# EasyEDA Pro project ProPrj_transverter-front-end_2026-04-14.epro, board 1-PCB_PCB_transverter-filter-board
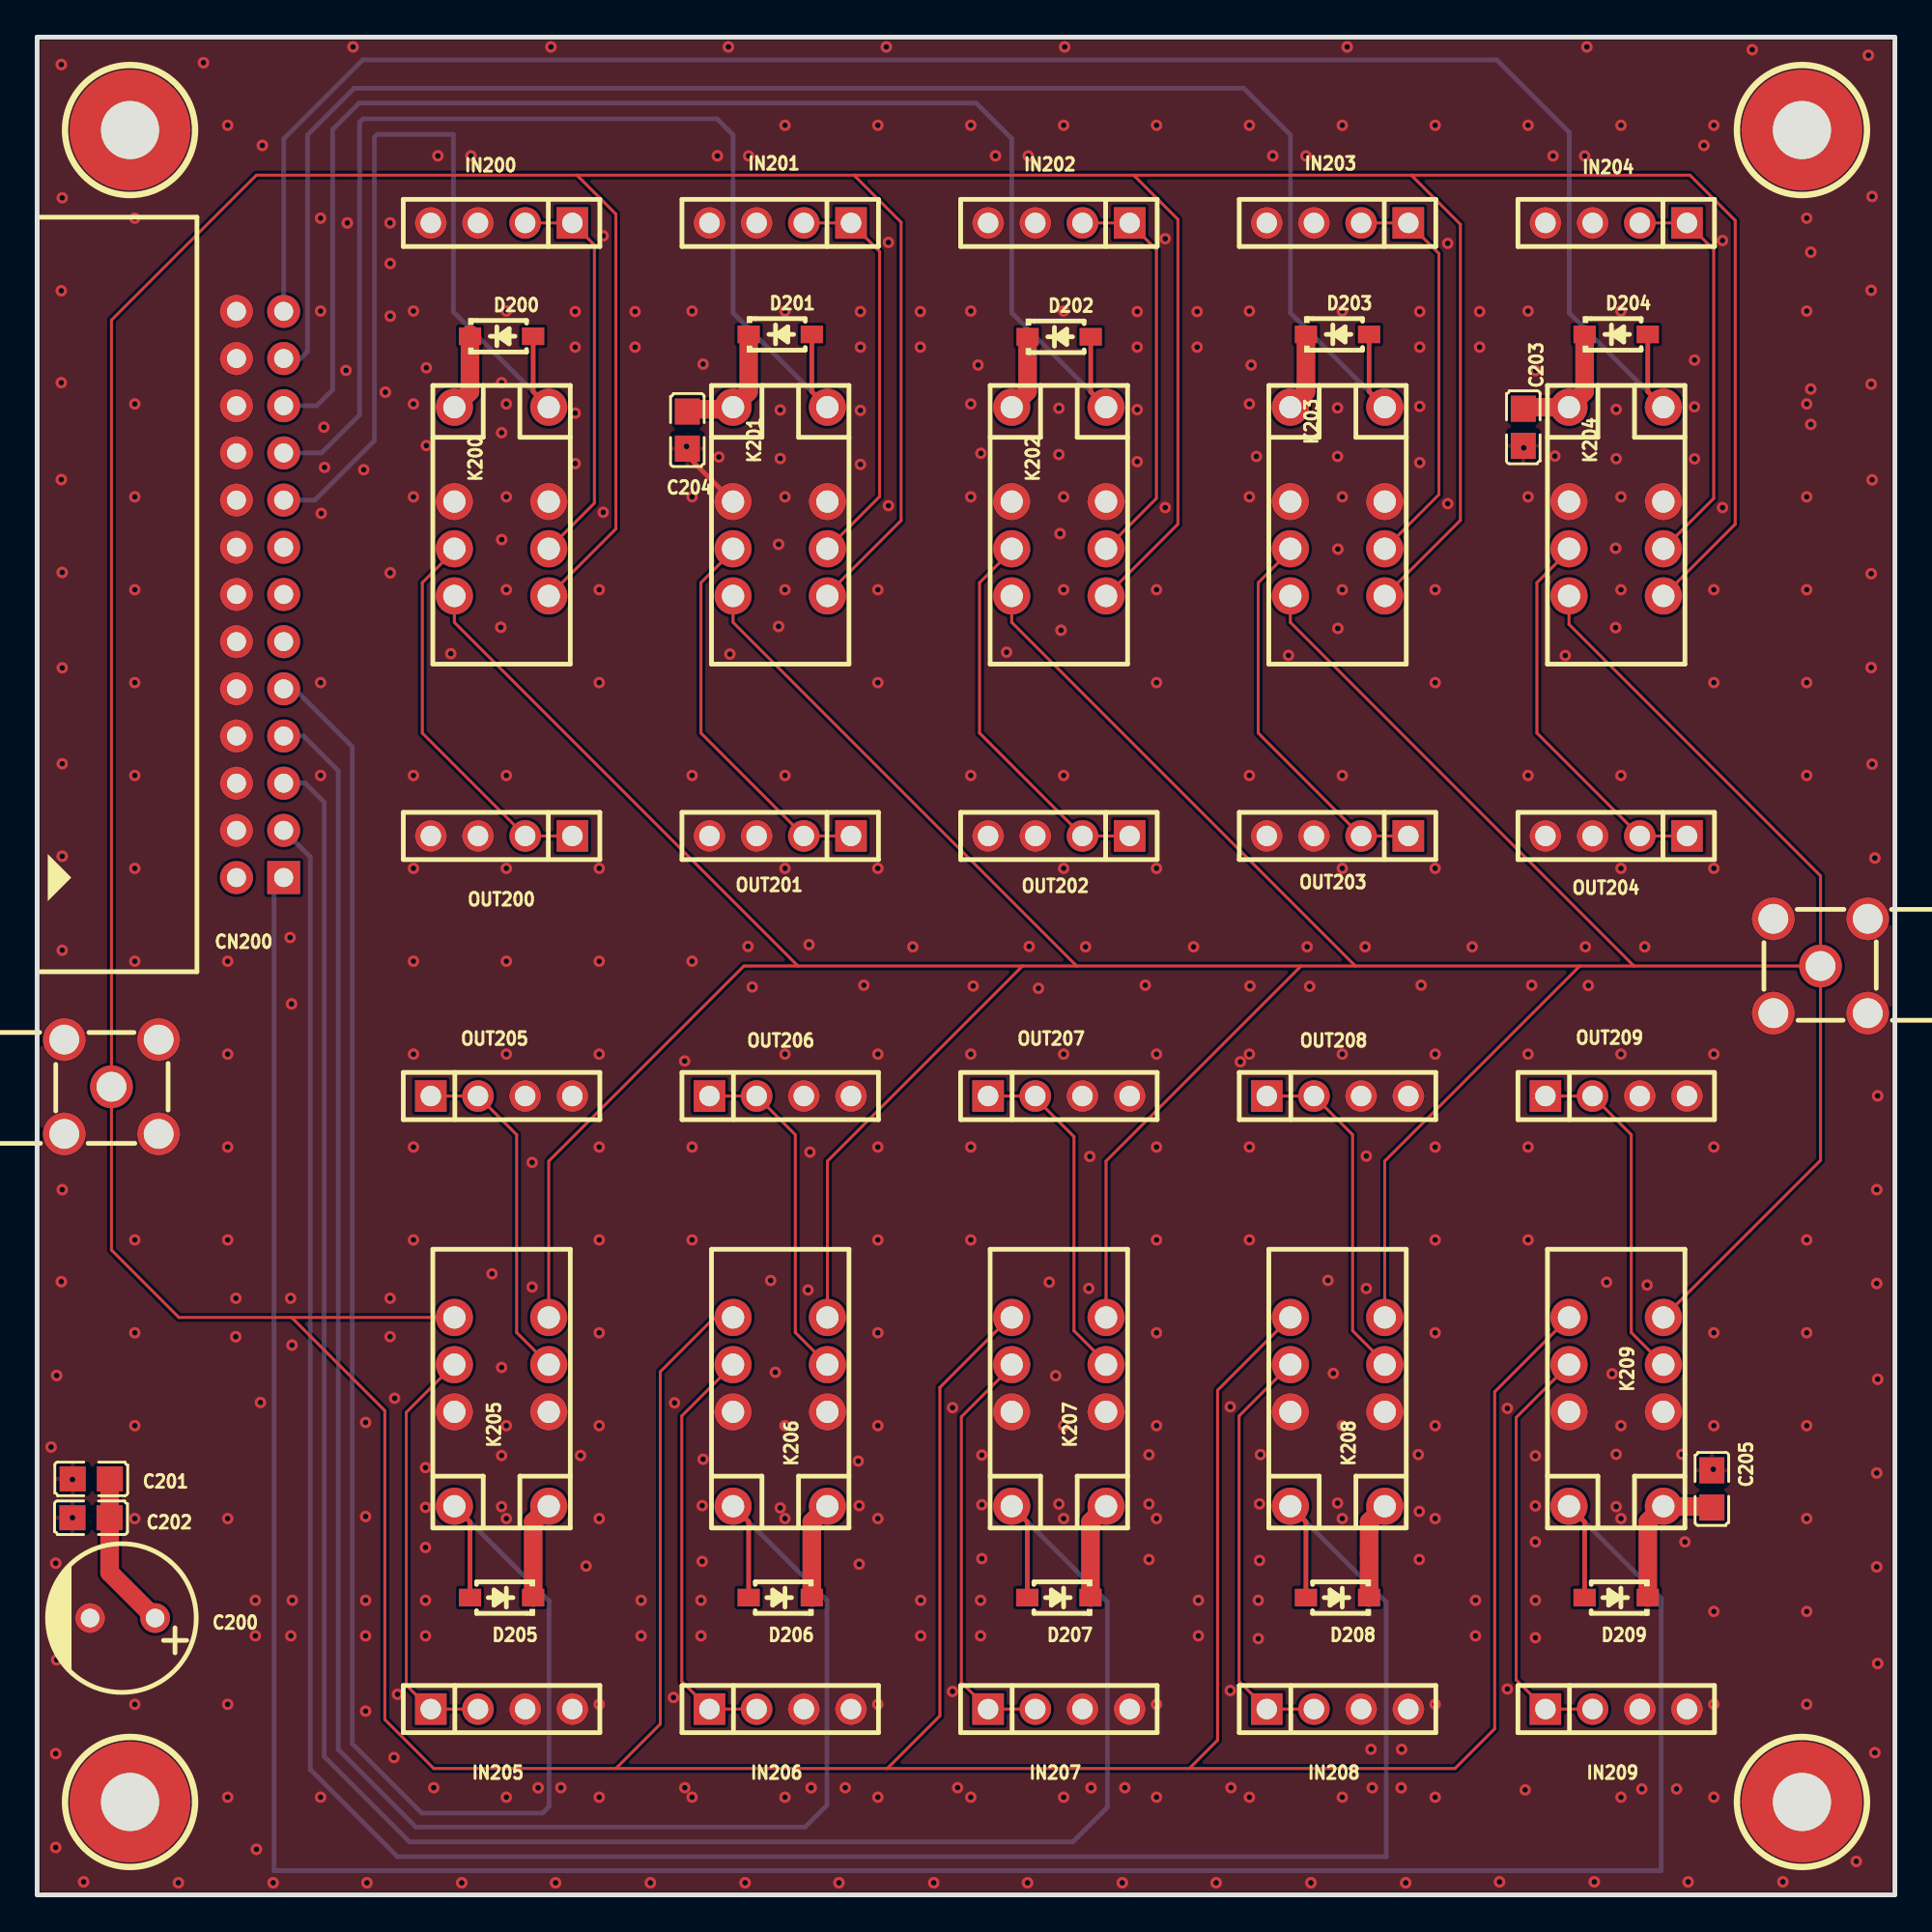
[diagram p7: board, top side]
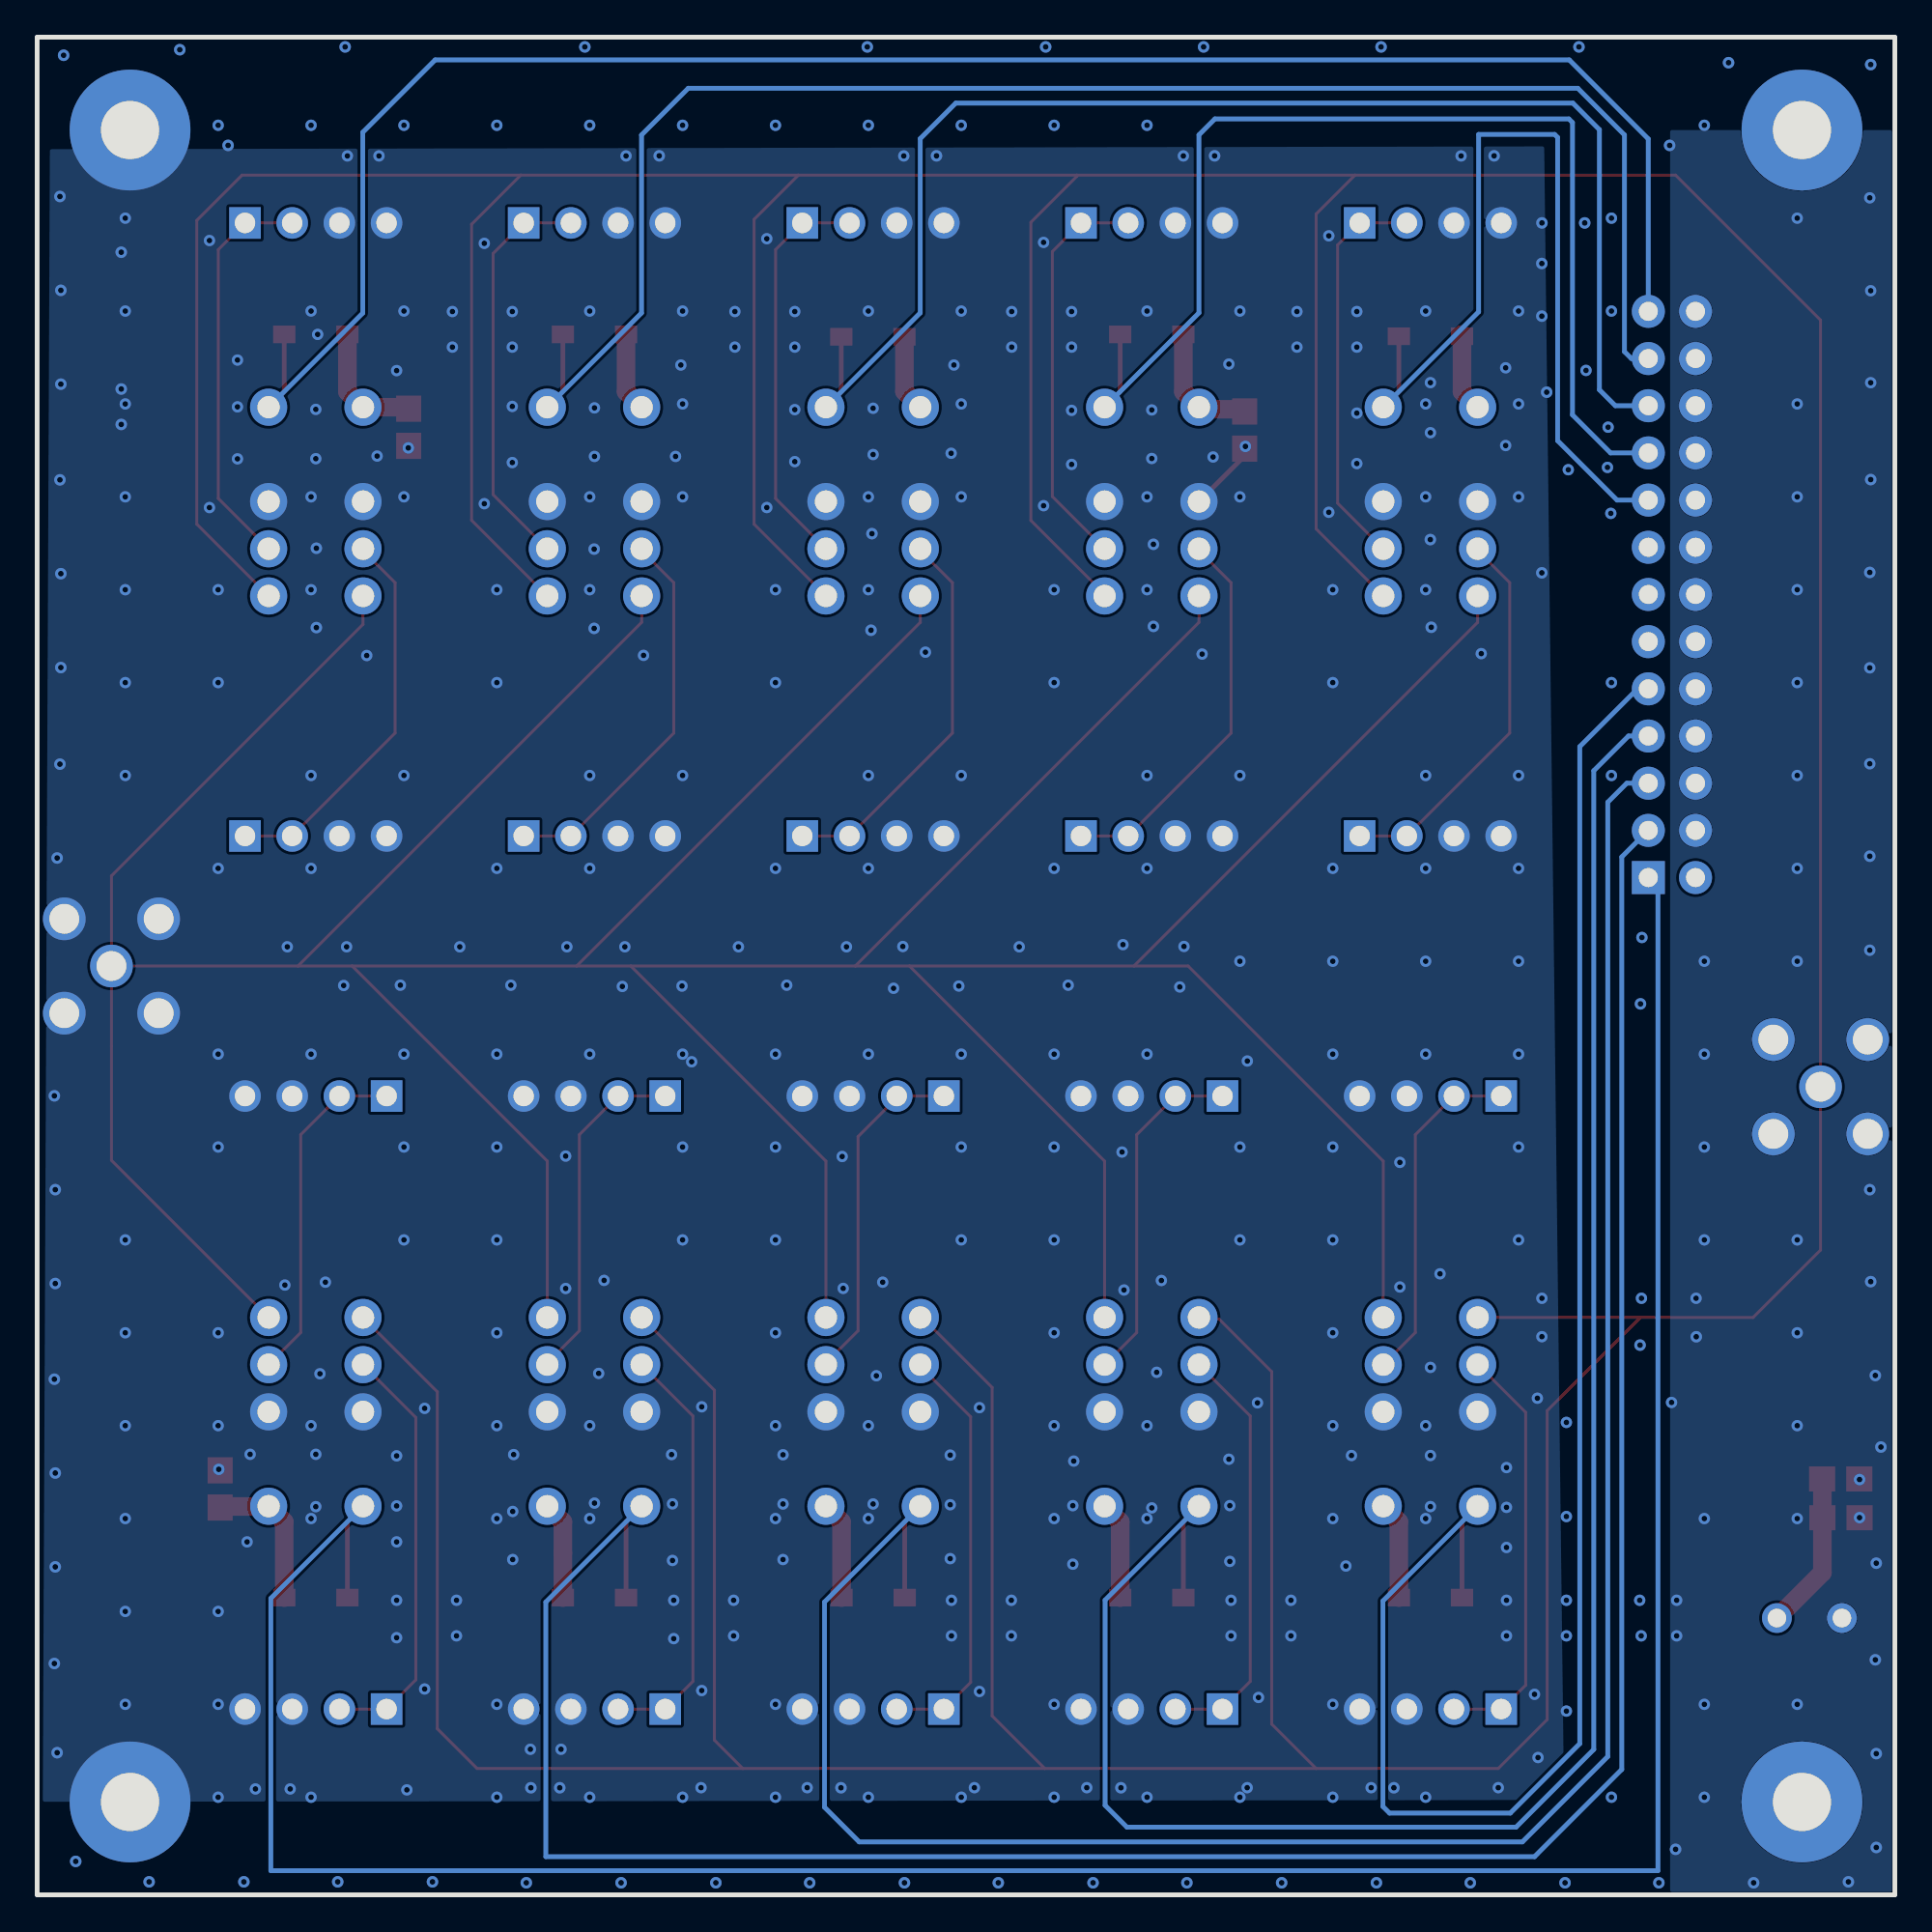
[diagram p8: board, bottom side, seen from below]

Outline 100 x 100 mm; copper layers: Top Layer, Inner1, Inner2, Bottom Layer. Coordinates in mm from the lower left corner of the outline.
Outline path: 0,100 0,0 100,0 100,100 0,100
Stack: Top Layer 0.035mm / Dielectric1 0.48mm PP er 4.5 / Inner1 0.035mm / Dielectric2 0.48mm FR4 er 4.5 / Inner2 0.035mm / Dielectric3 0.48mm PP er 4.5 / Bottom Layer 0.035mm

## Design rules (mm)
net RF-IN-BUS: RF
net RF-OUT-BUS: RF
net RLY-5-EN: control_lines
net RLY-2-EN: control_lines
net RLY-10-EN: control_lines
net RLY-4-EN: control_lines
net RLY-3-EN: control_lines
net RLY-1-EN: control_lines
net RLY-7-EN: control_lines
net RLY-8-EN: control_lines
net RLY-9-EN: control_lines
net RLY-6-EN: control_lines
net RF1-IN: RF
net RF2-IN: RF
net RF3-IN: RF
net RF4-IN: RF
net RF5-IN: RF
net RF6-IN: RF
net RF7-IN: RF
net RF8-IN: RF
net RF9-IN: RF
net RF10-IN: RF
net RF1-OUT: RF
net RF2-OUT: RF
net RF3-OUT: RF
net RF4-OUT: RF
net RF5-OUT: RF
net RF6-OUT: RF
net RF7-OUT: RF
net RF8-OUT: RF
net RF9-OUT: RF
net RF10-OUT: RF
template: User Custom Config
spacing Default (default): track to track 0.152, other pairs 0 to 0.152
spacing RF: track to track 1, other pairs 0 to 0.65
spacing clean_voltage: track to track 0.152, other pairs 0.152 to 0.3
spacing control_lines: track to track 0.5, other pairs 0.152 to 0.3
spacing ground_guard: track to track 0.3, other pairs 0.152 to 0.3
spacing main_power: track to track 2, other pairs 0.152 to 0.3
spacing relay_power: track to track 1, other pairs 0.152 to 0.3
spacing small_components: track to track 0.152, other pairs 0.152 to 0.3
spacing small_power: track to track 0.6, other pairs 0.152 to 0.3
track width Default: min 0.254, default 0.254, max 25.4
track width RF (default): min 0.157, default 0.157, max 0.157
track width control_lines: min 0.25, default 0.25, max 0.26
track width main_power: min 1.5, default 1.5, max 3
track width relay_power: min 1, default 1, max 1.25
track width small_power: min 0.5, default 0.5, max 2.54
differential pair differentialPair (default): width min 0.127, default 0.254, max 2.54; gap min 0.152, default 0.152
via Default (default): diameter min 0.61, default 0.61, max 100.025; hole min 0.305, default 0.305, max 59.995
via RF: diameter min 0.61, default 0.61, max 100.025; hole min 0.305, default 0.305, max 59.995
net class RF uses RF
net class control_lines uses control_lines
net RF-IN-BUS uses RF
net RF-OUT-BUS uses RF
net GND uses Default
net RLY-5-EN uses control_lines
net RLY-2-EN uses control_lines
net RLY-10-EN uses control_lines
net RLY-4-EN uses control_lines
net RLY-3-EN uses control_lines
net RLY-1-EN uses control_lines
net RLY-7-EN uses control_lines
net RLY-8-EN uses control_lines
net RLY-9-EN uses control_lines
net RLY-6-EN uses control_lines
net 5V-BUS uses relay_power
net RF1-IN uses RF
net RF2-IN uses RF
net RF3-IN uses RF
net RF4-IN uses RF
net RF5-IN uses RF
net RF6-IN uses RF
net RF7-IN uses RF
net RF8-IN uses RF
net RF9-IN uses RF
net RF10-IN uses RF
net RF1-OUT uses RF
net RF2-OUT uses RF
net RF3-OUT uses RF
net RF4-OUT uses RF
net RF5-OUT uses RF
net RF6-OUT uses RF
net RF7-OUT uses RF
net RF8-OUT uses RF
net RF9-OUT uses RF
net RF10-OUT uses RF
['net class', 'rf'] ['NET', 'GND'] uses ground_guard
pour e62 uses gge33003
pour e87 uses gge14488
pour e89 uses gge11851

## Placement (name value [footprint] x y rotation side)
C200  47 µF  [CAP-TH_BD8.0-P3.50-D0.6-FD]  4.6 14.9 180 top
C201  1uF  [C0805]  2.91 22.39 0 top
C202  100nF  [C0805]  2.9 20.3 180 top
C203  100nF  [C0805]  80 79 270 top
C204  100nF  [C0805]  35 78.85 90 top
C205  100nF  [C0805]  90.15 21.85 270 top
CN200  SBH11-PBPC-D13-RA-BK  [IDC-TH_26P-P2.54-H-M-R2-C13-W8.8]  12 70 270 top
D200  1N4148W-7-F  [SOD-123_L2.7-W1.6-LS3.7-RD-1]  25 83.9 0 top
D201  1N4148W-7-F  [SOD-123_L2.7-W1.6-LS3.7-RD-1]  40 84 0 top
D202  1N4148W-7-F  [SOD-123_L2.7-W1.6-LS3.7-RD-1]  55.01 83.87 0 top
D203  1N4148W-7-F  [SOD-123_L2.7-W1.6-LS3.7-RD-1]  70 84 0 top
D204  1N4148W-7-F  [SOD-123_L2.7-W1.6-LS3.7-RD-1]  85 84 0 top
D205  1N4148W-7-F  [SOD-123_L2.7-W1.6-LS3.7-RD-1]  25 16 180 top
D206  1N4148W-7-F  [SOD-123_L2.7-W1.6-LS3.7-RD-1]  40 16 180 top
D207  1N4148W-7-F  [SOD-123_L2.7-W1.6-LS3.7-RD-1]  55 16 180 top
D208  1N4148W-7-F  [SOD-123_L2.7-W1.6-LS3.7-RD-1]  70 16 180 top
D209  1N4148W-7-F  [SOD-123_L2.7-W1.6-LS3.7-RD-1]  85 16 180 top
IN200  PPPC041LFBN-RC  [HDR-TH_4P-P2.54-V-F]  25 90 180 top
IN201  PPPC041LFBN-RC  [HDR-TH_4P-P2.54-V-F]  40 90 180 top
IN202  PPPC041LFBN-RC  [HDR-TH_4P-P2.54-V-F]  55 90 180 top
IN203  PPPC041LFBN-RC  [HDR-TH_4P-P2.54-V-F]  70 90 180 top
IN204  PPPC041LFBN-RC  [HDR-TH_4P-P2.54-V-F]  85 90 180 top
IN205  PPPC041LFBN-RC  [HDR-TH_4P-P2.54-V-F]  25 10 0 top
IN206  PPPC041LFBN-RC  [HDR-TH_4P-P2.54-V-F]  40 10 0 top
IN207  PPPC041LFBN-RC  [HDR-TH_4P-P2.54-V-F]  55 10 0 top
IN208  PPPC041LFBN-RC  [HDR-TH_4P-P2.54-V-F]  70 10 0 top
IN209  PPPC041LFBN-RC  [HDR-TH_4P-P2.54-V-F]  85 10 0 top
K200  TX2-5V  [RELAY-TH_TX2-3V]  25 75 270 top
K201  TX2-5V  [RELAY-TH_TX2-3V]  40 75 270 top
K202  TX2-5V  [RELAY-TH_TX2-3V]  55 75 270 top
K203  TX2-5V  [RELAY-TH_TX2-3V]  70 75 270 top
K204  TX2-5V  [RELAY-TH_TX2-3V]  85 75 270 top
K205  TX2-5V  [RELAY-TH_TX2-3V]  25 26 90 top
K206  TX2-5V  [RELAY-TH_TX2-3V]  40 26 90 top
K207  TX2-5V  [RELAY-TH_TX2-3V]  55 26 90 top
K208  TX2-5V  [RELAY-TH_TX2-3V]  70 26 90 top
K209  TX2-5V  [RELAY-TH_TX2-3V]  85 26 90 top
NOREF  -  [Pad_e1373]  5 5 0 top
NOREF#2  -  [Pad_e1372]  95 5 0 top
NOREF#3  -  [Pad_e1371]  95 95 0 top
NOREF#4  -  [Pad_e1369]  5 95 0 top
OUT200  PPPC041LFBN-RC  [HDR-TH_4P-P2.54-V-F]  25 57 180 top
OUT201  PPPC041LFBN-RC  [HDR-TH_4P-P2.54-V-F]  40 57 180 top
OUT202  PPPC041LFBN-RC  [HDR-TH_4P-P2.54-V-F]  55 57 180 top
OUT203  PPPC041LFBN-RC  [HDR-TH_4P-P2.54-V-F]  70 57 180 top
OUT204  PPPC041LFBN-RC  [HDR-TH_4P-P2.54-V-F]  85 57 180 top
OUT205  PPPC041LFBN-RC  [HDR-TH_4P-P2.54-V-F]  25 43 0 top
OUT206  PPPC041LFBN-RC  [HDR-TH_4P-P2.54-V-F]  40 43 0 top
OUT207  PPPC041LFBN-RC  [HDR-TH_4P-P2.54-V-F]  55 43 0 top
OUT208  PPPC041LFBN-RC  [HDR-TH_4P-P2.54-V-F]  70 43 0 top
OUT209  PPPC041LFBN-RC  [HDR-TH_4P-P2.54-V-F]  85 43 0 top
SMA200  OUT  [ANT-TH_SMA-J-P-H-RA-TH1]  96 50 180 top
SMA201  IN  [ANT-TH_SMA-J-P-H-RA-TH1]  4 43.5 0 top

## Footprints (pads in the part's own frame, mm; a bottom-side part is the same pattern mirrored in y, then rotated)
ANT-TH_SMA-J-P-H-RA-TH1
  round 2.3 hole 1.6: 1(-2.54,2.54) 2(2.54,2.54) 3(2.54,-2.54) 4(-2.54,-2.54) 5(0,0)
C0805
  rect 1.41x1.35 smd: 1(-1,0) 2(1,0)
CAP-TH_BD8.0-P3.50-D0.6-FD
  round 1.6 hole 1: 1(-1.75,0) 2(1.75,0)
HDR-TH_4P-P2.54-V-F
  rect 1.7x1.7 hole 1.1: 1(-3.81,0)
  round 1.7 hole 1.1: 2(-1.27,0) 3(1.27,0) 4(3.81,0)
IDC-TH_26P-P2.54-H-M-R2-C13-W8.8
  rect 1.778x1.778 hole 1.02: 1(15.24,1.27)
  round 1.778 hole 1.02: 2(15.24,-1.27) 3(12.7,1.27) 4(12.7,-1.27) 5(10.16,1.27) 6(10.16,-1.27) 7(7.62,1.27) 8(7.62,-1.27) 9(5.08,1.27) 10(5.08,-1.27) 11(2.54,1.27) 12(2.54,-1.27) 13(0,1.27) 14(0,-1.27) 15(-2.54,1.27) 16(-2.54,-1.27) 17(-5.08,1.27) 18(-5.08,-1.27) 19(-7.62,1.27) 20(-7.62,-1.27) 21(-10.16,1.27) 22(-10.16,-1.27) 23(-12.7,1.27) 24(-12.7,-1.27) 25(-15.24,1.27) 26(-15.24,-1.27)
Pad_e1369
  round 6.5 hole 3.125: 1(0,0)
Pad_e1371
  round 6.5 hole 3.125: 1(0,0)
Pad_e1372
  round 6.5 hole 3.125: 1(0,0)
Pad_e1373
  round 6.5 hole 3.125: 1(0,0)
RELAY-TH_TX2-3V
  round 2 hole 1.2: 1(-5.08,-2.54) 3(0,-2.54) 4(2.54,-2.54) 5(5.08,-2.54) 8(5.08,2.54) 9(2.54,2.54) 10(0,2.54) 12(-5.08,2.54)
SOD-123_L2.7-W1.6-LS3.7-RD-1
  rect 1.2x0.95 smd: 1(-1.7,0) 2(1.7,0)

## Nets
As in the schematic, except:
GND: C200.2 C201.1 C202.2 C203.2 C204.1 C205.1 CN200.4 CN200.6 CN200.8 CN200.10 CN200.12 CN200.14 CN200.16 CN200.18 CN200.20 CN200.22 CN200.24 CN200.26 IN200.3 IN200.4 IN201.3 IN201.4 IN202.3 IN202.4 IN203.3 IN203.4 IN204.3 IN204.4 IN205.3 IN205.4 IN206.3 IN206.4 IN207.3 IN207.4 IN208.3 IN208.4 IN209.3 IN209.4 K200.3 K200.10 K201.3 K201.10 K202.3 K202.10 K203.3 K203.10 K204.3 K204.10 K205.3 K205.10 K206.3 K206.10 K207.3 K207.10 K208.3 K208.10 K209.3 K209.10 NOREF.1 NOREF#2.1 NOREF#3.1 NOREF#4.1 OUT200.3 OUT200.4 OUT201.3 OUT201.4 OUT202.3 OUT202.4 OUT203.3 OUT203.4 OUT204.3 OUT204.4 OUT205.3 OUT205.4 OUT206.3 OUT206.4 OUT207.3 OUT207.4 OUT208.3 OUT208.4 OUT209.3 OUT209.4 SMA200.1 SMA200.2 SMA200.3 SMA200.4 SMA201.1 SMA201.2 SMA201.3 SMA201.4

Pads without a net: CN200 2

## Via types
v1: diameter 0.61, hole 0.305, Top Layer to Bottom Layer, 403 vias
v2: diameter 0.62, hole 0.31, Top Layer to Bottom Layer, 97 vias

## Routing (per net, layer and track width the routed paths; a pad name or vN(x,y) marks a point on that pad's centre or on a via; arc(x,y) is an arc through that point)
5V-BUS: length 341.7
  Top Layer w1: D205.1 26.7,20.08 K205.1 ; 23.3,84 23.3,80.92 K200.1 ; D206.1 41.7,20.08 K206.1 ; D207.1 56.7,20.08 K207.1 ; 90.22,20.91 87.55,20.91 K209.1 86.7,20.08 D209.1 ; D208.1 71.7,20.08 K208.1 ; D201.1 38.3,80.92 K201.1 ; D203.1 68.3,80.92 K203.1 ; 3.9,22.36 C202.1 3.9,17.35 C200.1 ; D204.1 83.3,80.92 K204.1 79.98,80.08 79.87,79.97 ; K202.1 53.31,80.93 D202.1 ; 34.96,79.97 37.35,79.97
  Inner2 w1: K203.1 67.46,84.27 ; 67.46,84.27 82.46,84.27 ; 67.46,84.27 52.46,84.27 ; 67.46,84.27 67.46,84.3 ; 16.5,72.54 16.5,70 ; 16.5,72.54 13.27,72.54 ; 16.5,72.54 16.5,80.1 20.67,84.27 22.46,84.27 ; 16.5,70 16.5,67.46 ; 16.5,70 13.27,70 ; K206.1 42.54,14.9 ; 42.54,14.9 57.54,14.9 ; 42.54,14.9 27.54,14.9 ; 16.5,67.46 16.5,52.66 11.75,47.91 11.75,27.79 6.35,22.39 C200.1 27.54,14.9 ; 16.5,67.46 13.27,67.46 ; 57.54,14.9 72.54,14.9 ; 57.54,14.9 K207.1 ; 27.54,14.9 K205.1 ; 72.54,14.9 85.52,14.9 87.54,16.92 K209.1 ; 72.54,14.9 K208.1 ; 52.46,84.27 37.46,84.27 ; 52.46,84.27 52.46,84.3 ; 52.46,84.27 K202.1 ; 37.46,84.27 22.46,84.27 ; 37.46,84.27 K201.1 ; 37.46,84.27 37.46,84.3 ; 82.47,84.27 82.46,84.27 ; 82.46,84.27 82.46,84.3 ; 82.46,84.27 K204.1 ; 22.46,84.27 22.46,84.3 ; 22.46,84.27 K200.1
GND: length 4.5
  Top Layer w0.254: K201.3 34.96,77.5 34.96,77.97
  Top Layer w0.5: 29.16,43 OUT205.4 ; v2(80.02,77.89) 79.95,77.89 79.87,77.97
  vias: v1(1.35,91.35) v1(1.3,86.35) v1(1.3,81.4) v1(1.35,66.05) v1(1.35,60.89) v1(1.35,50.85) v1(5.26,90.26) v1(5.26,80.26) v1(5.26,75.26) v1(5.26,70.26) v1(5.26,65.26) v1(5.26,60.26) v1(5.26,55.26) v1(5.26,50.26) v1(5.26,35.26) v1(5.26,30.26) v1(5.26,25.26) v1(5.26,20.26) v1(5.26,10.26) v1(10.26,95.26) v1(10.26,50.26) v1(10.26,45.26) v1(10.26,40.26) v1(10.26,35.26) v1(10.26,20.26) v1(10.26,10.26) v1(10.26,5.26) v1(10.7,32.11) v1(11.75,15.86) v1(11.75,13.94) v1(12.02,26.5) v1(13.61,51.53) v1(13.64,32.11) v1(13.73,15.86) v1(13.66,13.94) v1(15.26,90.26) v1(15.26,85.26) v1(15.29,74.36) v1(15.26,65.26) v1(15.26,60.26) v1(15.26,5.26) v1(15.44,79) v1(15.47,76.84) v1(16.62,82.06) v1(17.58,76.72) v1(17.68,25.43) v1(17.68,20.37) v1(17.68,15.86) v1(17.68,13.94) v1(17.68,9.89) v1(19,32.11) v1(19,30.05) v1(19.24,26.73) v1(19.21,7.39) v1(19.4,10.79) v1(20.26,85.26) v1(20.26,80.26) v1(20.26,75.26) v1(20.26,60.26) v1(20.26,55.26) v1(20.26,50.26) v1(20.26,45.26) v1(20.26,40.26) v1(20.26,35.26) v1(20.91,23) v1(20.91,20.86) v1(20.91,18.7) v1(20.91,15.86) v1(20.91,13.94) v1(20.95,82.2) v1(20.95,78.02) v1(21.35,5.77) v1(22.26,66.81) v1(23.35,93.61) v1(24.48,33.43) v1(25,81.4) v1(25,78.71) v1(25,28.39) v1(25,23.65) v1(25,20.9) v1(25.26,85.26) v1(25.26,80.26) v1(25.26,75.26) v1(25.26,70.26) v1(25.26,60.26) v1(25.26,55.26) v1(25.26,50.26) v1(25.26,45.26) v1(25.26,25.26) v1(25.26,20.26) v1(25.26,5.26) v1(26.64,39.43) v1(26.64,32.72) v1(28.19,5.77) v1(28.96,85.23) v1(28.96,83.31) v1(28.96,79.76) v1(28.96,77.05) v1(29.25,23.65) v1(29.55,17.7) v1(30.26,70.26) v1(30.26,65.26) v1(30.26,55.26) v1(30.26,50.26) v1(30.26,45.26) v1(30.26,40.26) v1(30.26,35.26) v1(30.26,30.26) v1(30.26,25.26) v1(30.26,20.26) v1(30.26,10.26) v1(30.26,5.26) v1(30.47,89.31) v1(30.47,74.42) v1(32.19,85.23) v1(32.19,83.31) v1(32.51,15.86) v1(32.51,13.94) v1(34.31,26.49) v1(34.25,10.62) v1(34.86,44.89) v1(34.86,5.77) v1(35.26,85.26) v1(35.26,75.26) v1(35.26,60.26) v1(35.26,50.26) v1(35.26,40.26) v1(35.26,35.26) v1(35.26,5.26) v1(35.73,15.86) v1(35.73,13.94) v1(35.85,82.4) v1(35.85,23.45) v1(35.8,20.95) v1(35.8,17.95) v1(36.7,77.4) v1(37.29,66.79) v1(38.3,93.61) v1(38.27,51.05) v1(38.49,48.87) v1(39.48,33.07) v1(39.74,28.13) v1(40,79.93) v1(40,77.32) v1(40,20.83) v1(40.26,95.26) v1(40.26,85.26) v1(40.26,75.26) v1(40.26,70.26) v1(40.26,60.26) v1(40.26,55.26) v1(40.26,45.26) v1(40.26,25.26) v1(40.26,20.26) v1(40.26,5.26) v1(41.5,32.56) v1(41.55,51.15) v1(41.6,39.98) v1(43.5,5.77) v1(44.2,23.35) v1(44.25,20.95) v1(44.25,17.8) v1(44.32,85.23) v1(44.32,83.31) v1(44.32,79.91) v1(44.32,77) v1(44.5,48.97) v1(45.26,95.26) v1(45.26,70.26) v1(45.26,65.26) v1(45.26,55.26) v1(45.26,45.26) v1(45.26,40.26) v1(45.26,35.26) v1(45.26,30.26) v1(45.26,25.26) v1(45.26,20.26) v1(45.26,10.26) v1(45.26,5.26) v1(45.82,88.95) v1(45.82,74.78) v1(47.14,51.03) v1(47.54,85.23) v1(47.54,83.31) v1(47.56,15.86) v1(47.56,13.94) v1(49.28,26.23) v1(49.28,10.95) v1(49.55,5.77) v1(50.26,95.26) v1(50.26,85.26) v1(50.26,80.26) v1(50.26,75.26) v1(50.26,60.26) v1(50.26,45.26) v1(50.26,40.26) v1(50.26,35.26) v1(50.26,5.26) v1(50.39,48.92) v1(50.65,82.35) v1(50.8,77.6) v1(50.85,23.67) v1(50.85,21) v1(50.85,18.1) v1(50.78,15.86) v1(50.78,13.94) v1(52.18,66.89) v1(53.35,93.61) v1(53.4,51.05) v1(53.9,48.8) v1(54.48,32.98) v1(54.83,27.94) v1(55,80.02) v1(55,77.53) v1(55,21.04) v1(55.26,95.26) v1(55.26,85.26) v1(55.26,75.26) v1(55.26,70.26) v1(55.26,60.26) v1(55.26,55.26) v1(55.26,45.26) v1(55.26,25.26) v1(55.26,20.26) v1(55.26,5.26) v1(56.44,51.03) v1(56.61,32.64) v1(56.66,39.75) v1(58.55,5.77) v1(59.22,85.23) v1(59.22,83.31) v1(59.22,79.95) v1(59.22,77.15) v1(59.65,48.97) v1(59.85,23.69) v1(59.85,21.04) v1(59.85,18.05) v1(60.26,95.26) v1(60.26,70.26) v1(60.26,65.26) v1(60.26,55.26) v1(60.26,45.26) v1(60.26,40.26) v1(60.26,35.26) v1(60.26,30.26) v1(60.26,25.26) v1(60.26,20.26) v1(60.26,10.26) v1(60.26,5.26) v1(60.72,89.15) v1(60.72,74.68) v1(62.25,51.03) v1(62.44,85.23) v1(62.44,83.31) v1(62.51,15.86) v1(62.51,13.94) v1(64.23,26.27) v1(64.23,11) v1(64.26,5.77) v1(64.77,44.85) v1(65.26,95.26) v1(65.26,85.26) v1(65.35,82.35) v1(65.26,80.26) v1(65.26,75.26) v1(65.26,60.26) v1(65.29,48.92) v1(65.26,45.26) v1(65.26,40.26) v1(65.26,35.26) v1(65.26,5.26) v1(65.63,77.43) v1(65.73,15.86) v1(65.73,13.79) v1(65.85,23.7) v1(65.8,21.05) v1(65.8,18) v1(67.36,66.72) v1(68.3,93.61) v1(68.36,51.03) v1(68.5,48.9) v1(69.48,33.08) v1(69.77,28.07) v1(70,80.04) v1(70,77.43) v1(70,21.09) v1(70.26,95.26) v1(70.26,85.26) v1(70.26,75.26) v1(70.26,70.26) v1(70.26,60.26) v1(70.26,55.26) v1(70.26,45.26) v1(70.26,25.26) v1(70.26,20.26) v1(70.26,5.26) v1(71.48,51.03) v1(71.55,39.77) v1(71.55,32.64) v1(71.8,7.84) v1(73.45,7.84) v1(74.35,23.7) v1(74.42,85.23) v1(74.42,83.31) v1(74.42,80.12) v1(74.42,77.1) v1(74.4,20.64) v1(74.4,18.05) v1(74.5,48.97) v1(75.26,95.26) v1(75.26,70.26) v1(75.26,65.26) v1(75.26,55.26) v1(75.26,45.26) v1(75.26,40.26) v1(75.26,35.26) v1(75.26,30.26) v1(75.26,25.26) v1(75.26,20.26) v1(75.26,10.26) v1(75.26,5.26) v1(75.93,88.9) v1(75.93,74.89) v1(77.25,51.03) v1(77.43,15.86) v1(77.43,13.94) v1(77.65,85.23) v1(77.65,83.31) v1(79.14,26.19) v1(79.14,11.08) v1(80.1,5.65) v1(80.26,95.26) v1(80.26,85.26) v1(80.26,75.26) v1(80.26,60.26) v1(80.26,45.26) v1(80.26,40.26) v1(80.26,35.26) v1(80.45,48.97) v1(80.65,82.05) v1(80.65,23.63) v1(80.65,20.94) v1(80.65,19) v1(80.65,15.86) v1(80.65,13.84) v1(81.6,93.61) v1(81.7,77.45) v1(82.26,66.71) v1(83.3,93.61) v1(83.34,51.03) v1(83.5,48.95) v1(84.48,32.98) v1(84.78,28.05) v1(84.9,84) v1(85,79.96) v1(85,77.31) v1(85,23.71) v1(85,20.9) v1(85.26,95.26) v1(85.26,85.26) v1(85.26,75.26) v1(85.26,70.26) v1(85.26,60.26) v1(85.26,55.26) v1(85.26,45.26) v1(85.26,25.26) v1(85.26,20.26) v1(85.26,5.26) v1(86.38,5.7) v1(86.53,51.03) v1(86.66,32.83) v1(88.25,5.7) v1(88.54,23.71) v1(88.7,19) v1(89.22,82.62) v1(89.22,80.1) v1(89.22,77.3) v1(90.26,95.26) v1(90.26,70.26) v1(90.26,65.26) v1(90.26,55.26) v1(90.26,45.26) v1(90.26,40.26) v1(90.26,30.26) v1(90.26,25.26) v1(90.26,15.26) v1(90.26,10.26) v1(90.26,5.26) v1(90.72,89.05) v1(90.72,74.68) v1(95.26,90.26) v1(95.26,85.26) v1(95.26,80.26) v1(95.26,75.26) v1(95.26,70.26) v1(95.26,65.26) v1(95.26,60.26) v1(95.26,35.26) v1(95.26,30.26) v1(95.26,25.26) v1(95.26,20.26) v1(95.26,15.26) v1(95.26,10.26) v2(0.75,24.11) v2(1,17.85) v2(1,7.6) v2(1,2.55) v2(1.05,27.96) v2(1.05,12.65) v2(1.3,98.53) v2(1.3,76.18) v2(1.35,71.19) v2(1.35,55.91) v2(1.3,33.01) v2(1.35,37.96) v2(1.9,22.36) v2(1.9,20.31) v2(2.5,0.7) v2(7.6,0.65) v2(8.95,98.62) v2(10.69,30.04) v2(11.8,2.45) v2(12.12,94.17) v2(12.7,0.65) v2(13.69,47.96) v2(13.72,29.59) v2(16.69,90) v2(17,99.47) v2(17.75,0.65) v2(18.74,80.89) v2(19,90) v2(19,87.82) v2(19,84.98) v2(19,71.16) v2(21.57,93.61) v2(22.86,0.65) v2(25.01,72.95) v2(24.96,68.23) v2(26.97,5.76) v2(27.66,99.47) v2(27.91,0.65) v2(33.01,0.65) v2(34.96,77.97) v2(36.62,93.61) v2(37.21,99.47) v2(38.11,0.65) v2(39.91,72.7) v2(39.91,68.28) v2(41.66,5.76) v2(43.16,0.65) v2(45.71,99.47) v2(48.26,0.65) v2(51.59,93.61) v2(53.31,0.65) v2(55.06,73.27) v2(55.11,68.07) v2(55.31,99.47) v2(56.73,5.76) v2(58.41,0.65) v2(63.47,0.65) v2(66.51,93.61) v2(68.57,0.65) v2(70.02,72.44) v2(70.02,68.17) v2(70.52,99.47) v2(71.87,5.76) v2(73.42,5.76) v2(73.67,0.65) v2(78.72,0.7) v2(83.42,99.47) v2(83.82,0.7) v2(84.97,72.49) v2(84.97,68.22) v2(88.87,0.7) v2(89.72,94.17) v2(90.22,22.91) v2(92.32,99.33) v2(93.97,0.7) v2(95.47,88.42) v2(95.47,81.06) v2(95.47,79.15) v2(97.92,1.8) v2(98.57,99.03) v2(98.72,86.37) v2(98.72,81.32) v2(98.72,71.12) v2(98.72,66.07) v2(98.78,91.42) v2(98.78,76.17) v2(98.78,60.87) v2(98.93,55.81) v2(98.93,7.65) v2(99.03,37.96) v2(99.03,32.91) v2(99.03,22.71) v2(99.03,17.65) v2(99.07,43.01) v2(99.07,27.76) v2(99.07,12.45)
RF1-IN: length 21.6
  Top Layer w0.157: IN200.2 IN200.1 30,88.81 30,74.92 K200.9
RF1-OUT: length 21
  Top Layer w0.157: K200.4 22.46,72.36 20.73,70.64 20.73,62.54 OUT200.2 OUT200.1
RF2-IN: length 21.9
  Top Layer w0.157: K201.9 45.35,75.27 45.35,88.46 IN201.1 IN201.2
RF2-OUT: length 21
  Top Layer w0.157: K201.4 37.46,72.36 35.73,70.64 35.73,62.54 OUT201.2 OUT201.1
RF3-IN: length 21.8
  Top Layer w0.157: IN202.2 IN202.1 60.25,88.56 60.25,75.17 K202.9
RF3-OUT: length 21
  Top Layer w0.157: OUT202.1 OUT202.2 50.73,62.54 50.73,70.64 52.46,72.36 K202.4
RF4-IN: length 22
  Top Layer w0.157: IN203.2 IN203.1 75.46,88.35 75.46,75.38 K203.9
RF4-OUT: length 21
  Top Layer w0.157: OUT203.1 OUT203.2 65.73,62.54 65.73,70.64 67.46,72.36 K203.4
RF5-IN: length 21.8
  Top Layer w0.157: IN204.2 IN204.1 90.25,88.56 90.25,75.17 K204.9
RF5-OUT: length 21
  Top Layer w0.157: OUT204.1 OUT204.2 80.73,62.54 80.73,70.64 82.46,72.36 K204.4
RF6-IN: length 22.7
  Top Layer w0.157: IN205.2 IN205.1 21.16,10 19.87,11.29 19.87,25.97 22.44,28.54 K205.9
RF6-OUT: length 18.6
  Top Layer w0.157: OUT205.1 OUT205.2 25.81,40.92 25.81,30.27 K205.4
RF7-IN: length 22.8
  Top Layer w0.157: K206.9 34.7,25.78 34.7,11.49 IN206.1 IN206.2
RF7-OUT: length 18.6
  Top Layer w0.157: OUT206.1 OUT206.2 40.81,40.92 40.81,30.27 K206.4
RF8-IN: length 22.8
  Top Layer w0.157: K207.9 52.46,28.44 49.75,25.73 49.75,11.44 IN207.1 ; 51.19,10 53.73,10
RF8-OUT: length 18.6
  Top Layer w0.157: K207.4 57.54,28.64 55.81,30.36 55.81,40.81 53.73,42.89 OUT207.2 51.19,43
RF9-IN: length 22.8
  Top Layer w0.157: IN208.2 IN208.1 64.7,11.49 64.7,25.78 K208.9
RF9-OUT: length 18.6
  Top Layer w0.157: OUT208.1 OUT208.2 70.81,40.92 70.81,30.36 72.54,28.64 K208.4
RF10-IN: length 22.9
  Top Layer w0.157: K209.9 79.62,25.7 79.62,11.57 IN209.1 IN209.2
RF10-OUT: length 18.6
  Top Layer w0.157: OUT209.1 OUT209.2 85.81,40.92 85.81,30.27 K209.4
RF-IN-BUS: length 474.9
  Top Layer w0.157: K202.8 61.41,73.79 61.41,90.19 59.02,92.57 ; K207.8 52.36,31.08 48.59,27.31 48.59,9.63 45.76,6.8 ; 73.97,92.57 76.61,89.93 76.61,73.99 K203.8 ; 73.97,92.57 59.02,92.57 ; 73.97,92.57 88.97,92.57 91.41,90.13 91.41,73.79 K204.8 ; 59.02,92.57 44.03,92.57 ; 44.03,92.57 44.03,92.51 46.51,90.03 46.51,73.98 42.54,70.02 K201.8 ; 44.03,92.57 29.06,92.57 ; 13.7,31.08 18.71,26.06 18.71,9.44 21.35,6.8 31.15,6.8 ; 13.7,31.08 7.63,31.08 4,34.71 SMA201.5 4,84.77 11.8,92.57 29.06,92.57 ; 13.7,31.08 K205.8 ; 29.06,92.57 31.15,90.48 31.15,73.53 K200.8 ; K208.8 63.54,27.16 63.54,8.33 62.02,6.8 ; K206.8 37.37,30.99 36.37,30.99 33.54,28.16 33.54,9.19 31.15,6.8 ; K209.8 78.46,27.08 78.46,8.94 76.32,6.8 62.02,6.8 ; 31.15,6.8 45.76,6.8 ; 62.02,6.8 45.76,6.8
RF-OUT-BUS: length 309.3
  Top Layer w0.157: K204.5 82.46,68.39 96,54.85 SMA200.5 ; K207.5 57.54,39.5 68.04,50 ; SMA200.5 85.96,50 ; SMA200.5 96,39.54 K209.5 ; 85.96,50 67.46,68.5 K203.5 ; 85.96,50 83.04,50 ; 70.96,50 68.04,50 ; 70.96,50 83.04,50 ; 70.96,50 52.46,68.5 K202.5 ; 68.04,50 55.96,50 ; K201.5 37.46,68.5 55.96,50 ; K205.5 27.54,39.5 38.04,50 40.96,50 ; 83.04,50 72.54,39.5 K208.5 ; 55.96,50 53.04,50 ; 53.04,50 40.96,50 ; 53.04,50 42.54,39.5 K206.5 ; 40.96,50 22.46,68.5 K200.5
RLY-1-EN: length 47.9
  Top Layer w0.254: 26.7,84 26.7,80.92 K200.12
  Bottom Layer w0.254: 13.27,75.08 14.95,75.08 18.15,78.28 18.15,94.61 18.31,94.76 22.41,94.76 22.41,85.21 27.54,80.08
RLY-2-EN: length 62.2
  Top Layer w0.254: D201.2 41.7,80.92 K201.12
  Bottom Layer w0.254: 13.27,77.62 15.3,77.62 17.35,79.67 17.35,95.4 17.55,95.6 36.6,95.6 37.46,94.74 37.46,85.16 42.54,80.08
RLY-3-EN: length 75.6
  Top Layer w0.254: D202.2 56.71,80.91 K202.12
  Bottom Layer w0.254: 57.54,80.08 52.46,85.16 52.46,94.54 50.55,96.45 17.33,96.45 15.9,95.02 15.9,81.02 15.04,80.16 13.27,80.16
RLY-4-EN: length 89.1
  Top Layer w0.254: K203.12 71.7,80.92 D203.2
  Bottom Layer w0.254: 13.27,82.7 14.18,82.7 14.55,83.07 14.55,94.74 17.07,97.25 64.95,97.25 67.47,94.73 67.47,85.15 72.54,80.08
RLY-5-EN: length 103
  Top Layer w0.254: K204.12 86.7,80.92 D204.2
  Bottom Layer w0.254: 13.27,85.24 13.27,94.52 17.53,98.78 78.57,98.78 82.47,94.88 82.47,85.15 87.54,80.08
RLY-6-EN: length 94.5
  Top Layer w0.254: D205.2 23.3,20.08 K205.12
  Bottom Layer w0.254: 13.27,64.92 13.85,64.92 16.96,61.81 16.96,8.14 20.7,4.4 27.2,4.4 27.56,4.76 27.56,15.82 K205.12
RLY-7-EN: length 108.4
  Top Layer w0.254: D206.2 38.3,20.08 K206.12
  Bottom Layer w0.254: K206.12 42.51,15.87 42.51,4.82 41.34,3.65 20.39,3.65 16.21,7.83 16.21,60.51 14.34,62.38 13.27,62.38
RLY-8-EN: length 122.4
  Top Layer w0.254: D207.2 53.3,20.08 K207.12
  Bottom Layer w0.254: 13.27,59.84 14.43,59.84 15.45,58.82 15.45,7.45 20.05,2.85 55.75,2.85 57.62,4.72 57.62,15.77 K207.12
RLY-9-EN: length 137.3
  Top Layer w0.254: D208.2 68.3,20.08 K208.12
  Bottom Layer w0.254: K208.12 72.62,15.76 72.62,2.05 19.4,2.05 14.7,6.75 14.7,55.87 13.27,57.3
RLY-10-EN: length 155.6
  Top Layer w0.254: K209.12 83.3,20.08 D209.2
  Bottom Layer w0.254: 13.27,54.76 12.75,54.76 12.75,1.3 87.42,1.3 87.42,15.96 K209.12

## Copper pours and planes (outline as drawn; the poured copper is in the pictures)
GND on Top Layer: 0,100 100,100 100,0 0,0
GND on Bottom Layer: 18.97,94.02 99.22,93.87 99.59,5.11 17.91,5.21
GND on Bottom Layer: 0,95 12.1,95 12.1,0 0,0
GND on Inner1: -0.6,-0.15 99.22,-0.05 99.32,99.83 -0.65,99.83
GND on Inner2: 0.35,99.47 99.62,99.62 99.88,0.1 0.1,0.05
